# Altium project V1.PrjPcb
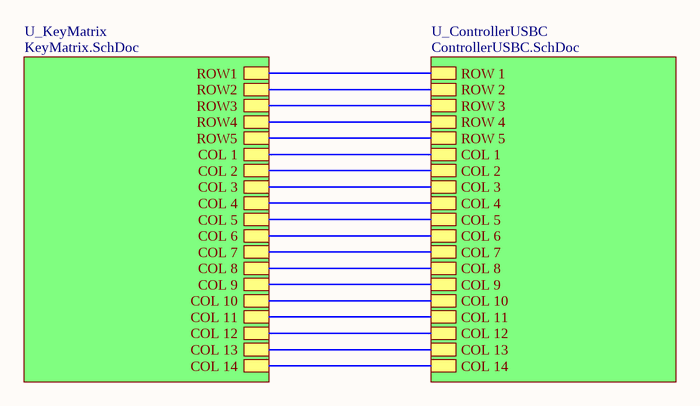
[diagram p0: V1.SchDoc]
3 sheets, 174 parts. Net scope: hierarchical (ports join the sheet entries above them; power ports are global).
Board file: V1.PcbDoc
Sheets:
  V1.SchDoc
    U_ControllerUSBC = ControllerUSBC.SchDoc
    U_KeyMatrix = KeyMatrix.SchDoc

## Sheet V1.SchDoc
size A4; Organization: Altium Limited; Address1: L3, 12a Rodborough Rd; Address2: Frenchs Forest; Address3: NSW; Address4: Australia 2086

### Sub-sheets
U_ControllerUSBC = ControllerUSBC.SchDoc: ROW 1, ROW 2, ROW 3, ROW 4, ROW 5, COL 1, COL 2, COL 3, COL 4, COL 5, COL 6, COL 7, COL 8, COL 9, COL 10, COL 11, COL 12, COL 13, COL 14
U_KeyMatrix = KeyMatrix.SchDoc: ROW1, ROW2, ROW3, ROW4, ROW5, COL 1, COL 2, COL 3, COL 4, COL 5, COL 6, COL 7, COL 8, COL 9, COL 10, COL 11, COL 12, COL 13, COL 14

### Nets
Net0_MX2: sheet U_ControllerUSBC/COL 11, sheet U_KeyMatrix/COL 11
Net1_MX2: sheet U_ControllerUSBC/COL 2, sheet U_KeyMatrix/COL 2
Net2_MX2: sheet U_ControllerUSBC/COL 3, sheet U_KeyMatrix/COL 3
Net3_MX2: sheet U_ControllerUSBC/COL 4, sheet U_KeyMatrix/COL 4
Net4_MX2: sheet U_ControllerUSBC/COL 5, sheet U_KeyMatrix/COL 5
Net5_MX2: sheet U_ControllerUSBC/COL 6, sheet U_KeyMatrix/COL 6
Net6_MX2: sheet U_ControllerUSBC/COL 7, sheet U_KeyMatrix/COL 7
Net7_MX2: sheet U_ControllerUSBC/COL 8, sheet U_KeyMatrix/COL 8
Net8_MX2: sheet U_ControllerUSBC/COL 9, sheet U_KeyMatrix/COL 9
Net9_MX2: sheet U_ControllerUSBC/COL 10, sheet U_KeyMatrix/COL 10
NetAPOSTRO_MX2: sheet U_ControllerUSBC/COL 12, sheet U_KeyMatrix/COL 12
NetBACKSPACE_MX2: sheet U_ControllerUSBC/COL 14, sheet U_KeyMatrix/COL 14
NetCAPS_MX2: sheet U_ControllerUSBC/COL 1, sheet U_KeyMatrix/COL 1
NetD1_C: sheet U_ControllerUSBC/ROW 1, sheet U_KeyMatrix/ROW1
NetD15_C: sheet U_ControllerUSBC/ROW 2, sheet U_KeyMatrix/ROW2
NetD29_C: sheet U_ControllerUSBC/ROW 3, sheet U_KeyMatrix/ROW3
NetD42_C: sheet U_ControllerUSBC/ROW 4, sheet U_KeyMatrix/ROW4
NetD54_C: sheet U_ControllerUSBC/ROW 5, sheet U_KeyMatrix/ROW5
NetENTER_MX2: sheet U_ControllerUSBC/COL 13, sheet U_KeyMatrix/COL 13

### Notes on the sheet
- Title
- Size:
- Date:
- A4
- Number:
- Time:
- Revision:
- Sheet
- of
- File:

## Sheet ControllerUSBC.SchDoc
size A4; Organization: Altium Limited; Address1: L3, 12a Rodborough Rd; Address2: Frenchs Forest; Address3: NSW; Address4: Australia 2086
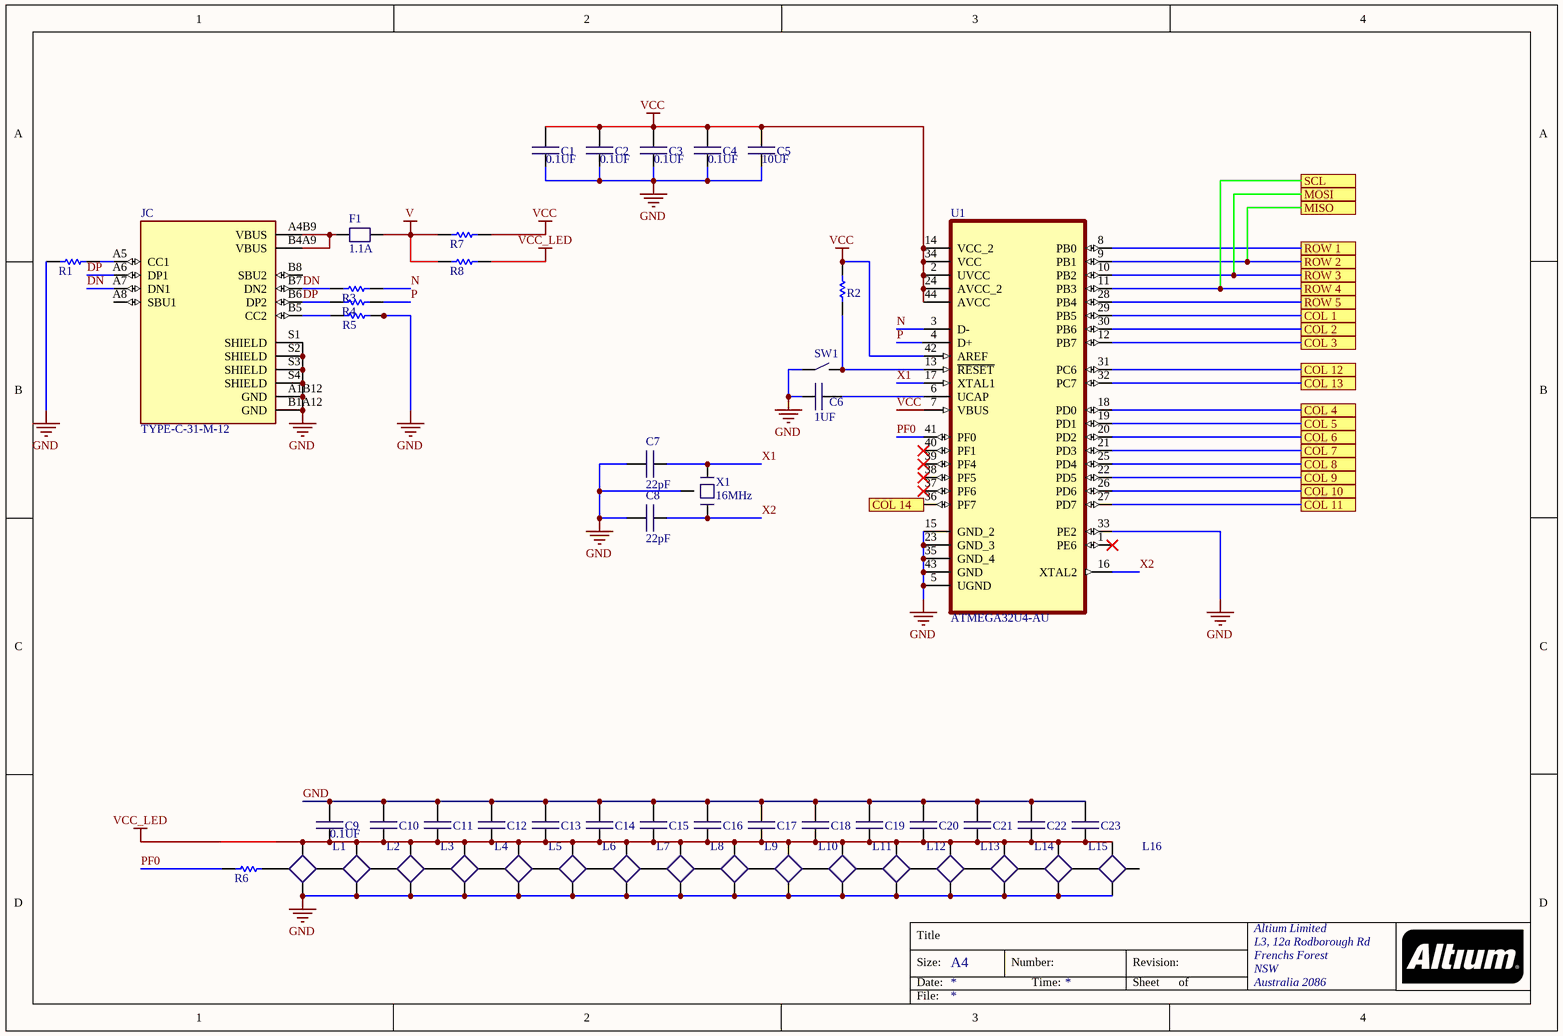
[diagram p1: ControllerUSBC.SchDoc]

### Parts
C1  0.1UF  [C0402]
C2  0.1UF  [C0402]
C3  0.1UF  [C0402]
C4  0.1UF  [C0402]
C5  10UF  [C0402]
C6  1UF  [C0402]
C7  22pF  [C0402]
C8  22pF  [C0402]
C9  0.1UF  [C0402]
C10  0.1UF  [C0402]  (value not drawn)
C11  0.1UF  [C0402]  (value not drawn)
C12  0.1UF  [C0402]  (value not drawn)
C13  0.1UF  [C0402]  (value not drawn)
C14  0.1UF  [C0402]  (value not drawn)
C15  0.1UF  [C0402]  (value not drawn)
C16  0.1UF  [C0402]  (value not drawn)
C17  0.1UF  [C0402]  (value not drawn)
C18  0.1UF  [C0402]  (value not drawn)
C19  0.1UF  [C0402]  (value not drawn)
C20  0.1UF  [C0402]  (value not drawn)
C21  0.1UF  [C0402]  (value not drawn)
C22  0.1UF  [C0402]  (value not drawn)
C23  0.1UF  [C0402]  (value not drawn)
F1  1.1A  [F1206]
JC  TYPE-C-31-M-12  [HRO_TYPE-C-31-M-12]
L1  WS2812B3535  [Neopixel3535]  (value not drawn)
L2  WS2812B3535  [Neopixel3535]  (value not drawn)
L3  WS2812B3535  [Neopixel3535]  (value not drawn)
L4  WS2812B3535  [Neopixel3535]  (value not drawn)
L5  WS2812B3535  [Neopixel3535]  (value not drawn)
L6  WS2812B3535  [Neopixel3535]  (value not drawn)
L7  WS2812B3535  [Neopixel3535]  (value not drawn)
L8  WS2812B3535  [Neopixel3535]  (value not drawn)
L9  WS2812B3535  [Neopixel3535]  (value not drawn)
L10  WS2812B3535  [Neopixel3535]  (value not drawn)
L11  WS2812B3535  [Neopixel3535]  (value not drawn)
L12  WS2812B3535  [Neopixel3535]  (value not drawn)
L13  WS2812B3535  [Neopixel3535]  (value not drawn)
L14  WS2812B3535  [Neopixel3535]  (value not drawn)
L15  WS2812B3535  [Neopixel3535]  (value not drawn)
L16  WS2812B3535  [Neopixel3535]  (value not drawn)
R1  resistor  [R0402]  (value not drawn)
R2  resistor  [R0402]  (value not drawn)
R3  resistor  [R0402]  (value not drawn)
R4  resistor  [R0402]  (value not drawn)
R5  resistor  [R0402]  (value not drawn)
R6  resistor  [R0402]  (value not drawn)
R7  0 Ohm  [R0402]  (value not drawn)
R8  0 Ohm  [R0402]  (value not drawn)
SW1  Switch_Tactile_EVP  [SW_EVP-BB2A9B000]  (value not drawn)
U1  ATMEGA32U4-AU  [QFPN_ATMEGA32U4-44N]
X1  16MHz  [CRYSTAL-3.2X2.5]

### Ports
COL 1, COL 2, COL 3, COL 4, COL 5, COL 6, COL 7, COL 8, COL 9, COL 10, COL 11, COL 12, COL 13, COL 14, MISO, MOSI, ROW 1, ROW 2, ROW 3, ROW 4, ROW 5, SCL

### Nets
GND: C1.1 C2.1 C3.1 C4.1 C5.1 C6.1 C7.2 C8.2 C9.2 C10.2 C11.2 C12.2 C13.2 C14.2 C15.2 C16.2 C17.2 C18.2 C19.2 C20.2 C21.2 C22.2 C23.2 JC.A1B12(GND) JC.B1A12(GND) JC.S1(SHIELD) JC.S2(SHIELD) JC.S3(SHIELD) JC.S4(SHIELD) L1.3-GND(GND) L2.3-GND(GND) L3.3-GND(GND) L4.3-GND(GND) L5.3-GND(GND) L6.3-GND(GND) L7.3-GND(GND) L8.3-GND(GND) L9.3-GND(GND) L10.3-GND(GND) L11.3-GND(GND) L12.3-GND(GND) L13.3-GND(GND) L14.3-GND(GND) L15.3-GND(GND) L16.3-GND(GND) R1.1 R5.2 SW1.A U1.5(UGND) U1.15(GND_2) U1.23(GND_3) U1.33(PE2) U1.35(GND_4) U1.43(GND) X1.2,_4
V: F1.2 R7.1 R8.1
VCC: C1.2 C2.2 C3.2 C4.2 C5.2 R2.2 R7.2 U1.2(UVCC) U1.7(VBUS) U1.14(VCC_2) U1.24(AVCC_2) U1.34(VCC) U1.42(AREF) U1.44(AVCC)
VCC_LED: C9.1 C10.1 C11.1 C12.1 C13.1 C14.1 C15.1 C16.1 C17.1 C18.1 C19.1 C20.1 C21.1 C22.1 C23.1 L1.1-VDD(VDD) L2.1-VDD(VDD) L3.1-VDD(VDD) L4.1-VDD(VDD) L5.1-VDD(VDD) L6.1-VDD(VDD) L7.1-VDD(VDD) L8.1-VDD(VDD) L9.1-VDD(VDD) L10.1-VDD(VDD) L11.1-VDD(VDD) L12.1-VDD(VDD) L13.1-VDD(VDD) L14.1-VDD(VDD) L15.1-VDD(VDD) L16.1-VDD(VDD) R8.2
DN: JC.A7(DN1) JC.B7(DN2) R3.1
DP: JC.A6(DP1) JC.B6(DP2) R4.1
N: R3.2 U1.3(D-)
P: R4.2 U1.4(D+)
PF0: R6.2 U1.41(PF0)
X1: C7.1 U1.17(XTAL1) X1.1
X2: C8.1 U1.16(XTAL2) X1.3
Net0_MX2: U1.27(PD7) ; port COL 11
Net1_MX2: U1.30(PB6) ; port COL 2
Net2_MX2: U1.12(PB7) ; port COL 3
Net3_MX2: U1.18(PD0) ; port COL 4
Net4_MX2: U1.19(PD1) ; port COL 5
Net5_MX2: U1.20(PD2) ; port COL 6
Net6_MX2: U1.21(PD3) ; port COL 7
Net7_MX2: U1.25(PD4) ; port COL 8
Net8_MX2: U1.22(PD5) ; port COL 9
Net9_MX2: U1.26(PD6) ; port COL 10
NetAPOSTRO_MX2: U1.31(PC6) ; port COL 12
NetBACKSPACE_MX2: U1.36(PF7) ; port COL 14
NetC6_2: C6.2 U1.6(UCAP)
NetCAPS_MX2: U1.29(PB5) ; port COL 1
NetD1_C: U1.8(PB0) ; port ROW 1
NetD15_C: U1.9(PB1) ; port ROW 2, port MISO
NetD29_C: U1.10(PB2) ; port ROW 3, port MOSI
NetD42_C: U1.11(PB3) ; port ROW 4, port SCL
NetD54_C: U1.28(PB4) ; port ROW 5
NetENTER_MX2: U1.32(PC7) ; port COL 13
NetF1_1: F1.1 JC.A4B9(VBUS) JC.B4A9(VBUS)
NetJC_A5: JC.A5(CC1) R1.2
NetJC_B5: JC.B5(CC2) R5.1
NetL1_2-DOUT: L1.2-DOUT(DOUT) L2.4-DIN(DIN)
NetL1_4-DIN: L1.4-DIN(DIN) R6.1
NetL2_2-DOUT: L2.2-DOUT(DOUT) L3.4-DIN(DIN)
NetL3_2-DOUT: L3.2-DOUT(DOUT) L4.4-DIN(DIN)
NetL4_2-DOUT: L4.2-DOUT(DOUT) L5.4-DIN(DIN)
NetL5_2-DOUT: L5.2-DOUT(DOUT) L6.4-DIN(DIN)
NetL6_2-DOUT: L6.2-DOUT(DOUT) L7.4-DIN(DIN)
NetL7_2-DOUT: L7.2-DOUT(DOUT) L8.4-DIN(DIN)
NetL8_2-DOUT: L8.2-DOUT(DOUT) L9.4-DIN(DIN)
NetL9_2-DOUT: L9.2-DOUT(DOUT) L10.4-DIN(DIN)
NetL10_2-DOUT: L10.2-DOUT(DOUT) L11.4-DIN(DIN)
NetL11_2-DOUT: L11.2-DOUT(DOUT) L12.4-DIN(DIN)
NetL12_2-DOUT: L12.2-DOUT(DOUT) L13.4-DIN(DIN)
NetL13_2-DOUT: L13.2-DOUT(DOUT) L14.4-DIN(DIN)
NetL14_2-DOUT: L14.2-DOUT(DOUT) L15.4-DIN(DIN)
NetL15_2-DOUT: L15.2-DOUT(DOUT) L16.4-DIN(DIN)
NetR2_1: R2.1 SW1.B U1.13(~{RESET})

Not connected (* = marked no-connect by the designer): JC A8(SBU1) B8(SBU2); L16 2-DOUT(DOUT); U1 1(PE6)* 37(PF6)* 38(PF5)* 39(PF4)* 40(PF1)*

### Notes on the sheet
- Title
- Size:
- Date:
- A4
- Number:
- Time:
- Revision:
- Sheet
- of
- File:

### Library data of the parts
C1-C23 = C0402
F1 = Fuse 1206
JC = TYPE-C-31-M-12: USB Connectors 24 Receptacle 1 8.94*7.3mm RoHS; MF: HRO Electronics Co., Ltd.; Value: *; SnapEDA_Link: https://www.snapeda.com/parts/TYPE-C-31-M-12/HRO%20Electronics%20Co.,%20Ltd./view-part/3228496/?ref=snap; Package: Package; MP: TYPE-C-31-M-12; Price: None; Availability: Unavailable
L1-L16 = WS2812B3535: MF: SparkFun Electronics; Availability: Unavailable; SnapEDA_Link: https://www.snapeda.com/parts/WS2812B/Worldsemi/view-part/1038297/?ref=snap; MP: WS2812B; Price: None; Value: *; Package: None
R5 = resistor: 5.1k
R7 R8 = resistor
U1 = ATMEGA32U4-AU: AVR AVRÂ® ATmega Microcontroller IC 8-Bit 16MHz 32KB _16K x 16_ FLASH 44-TQFP _10x10_; MF: Microchip Technology; Value: *; SnapEDA_Link: https://www.snapeda.com/parts/ATMEGA32U4-AU/Microchip/view-part/4251478/?ref=snap; MP: ATMEGA32U4-AU; Availability: Unavailable; Price: None; Package: TQFP-44 Microchip Technology
X1 = Crystal 3x2.5

## Sheet KeyMatrix.SchDoc
size A4; Organization: Altium Limited; Address1: L3, 12a Rodborough Rd; Address2: Frenchs Forest; Address3: NSW; Address4: Australia 2086
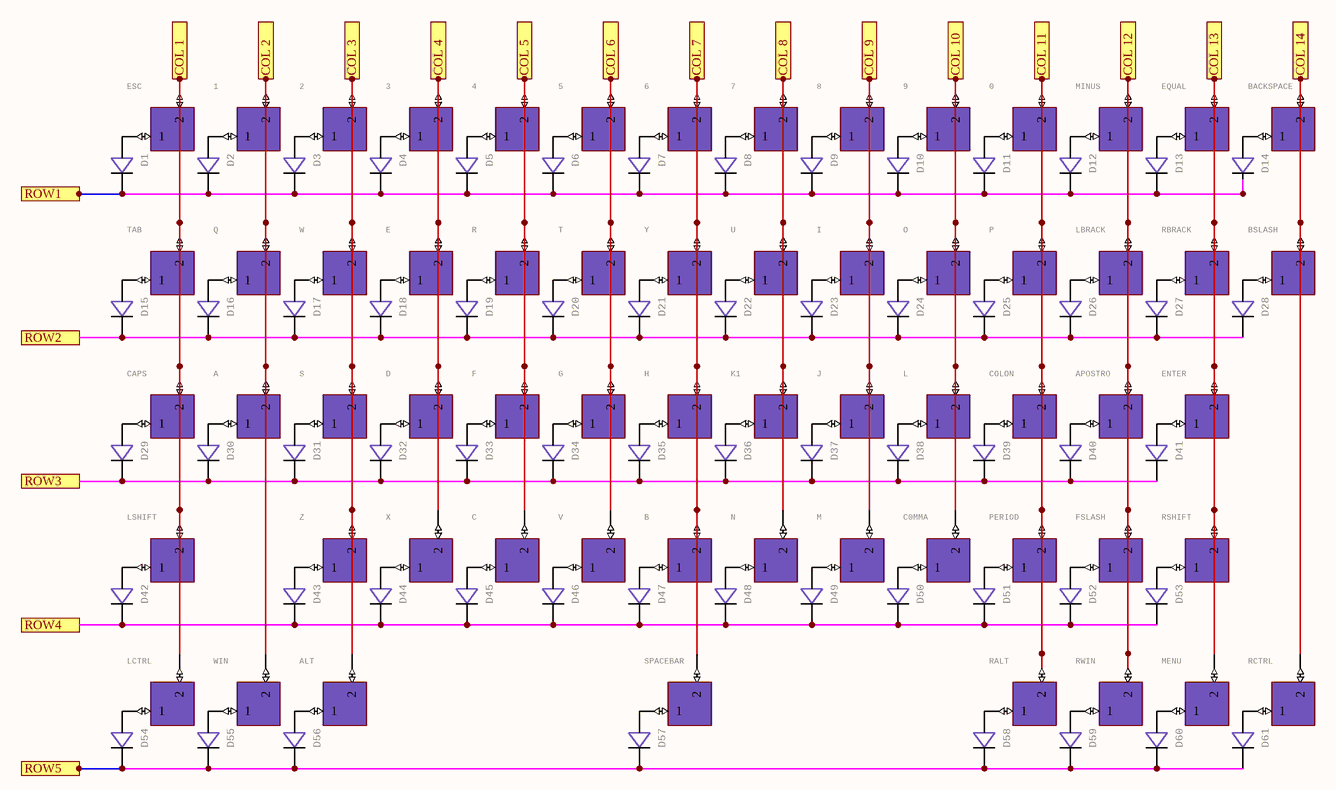
[diagram p2: KeyMatrix.SchDoc]

### Parts
0  KEYSWITCH-PLAIN-MXHSPCB-1U  [MXHSPCB-1U]  (value not drawn)
1  KEYSWITCH-PLAIN-MXHSPCB-1U  [MXHSPCB-1U]  (value not drawn)
2  KEYSWITCH-PLAIN-MXHSPCB-1U  [MXHSPCB-1U]  (value not drawn)
3  KEYSWITCH-PLAIN-MXHSPCB-1U  [MXHSPCB-1U]  (value not drawn)
4  KEYSWITCH-PLAIN-MXHSPCB-1U  [MXHSPCB-1U]  (value not drawn)
5  KEYSWITCH-PLAIN-MXHSPCB-1U  [MXHSPCB-1U]  (value not drawn)
6  KEYSWITCH-PLAIN-MXHSPCB-1U  [MXHSPCB-1U]  (value not drawn)
7  KEYSWITCH-PLAIN-MXHSPCB-1U  [MXHSPCB-1U]  (value not drawn)
8  KEYSWITCH-PLAIN-MXHSPCB-1U  [MXHSPCB-1U]  (value not drawn)
9  KEYSWITCH-PLAIN-MXHSPCB-1U  [MXHSPCB-1U]  (value not drawn)
A  KEYSWITCH-PLAIN-MXHSPCB-1U  [MXHSPCB-1U]  (value not drawn)
ALT  KEYSWITCH-PLAIN-MXHSPCB-1U  [MXHSPCB-1U]  (value not drawn)
APOSTRO  KEYSWITCH-PLAIN-MXHSPCB-1U  [MXHSPCB-1U]  (value not drawn)
B  KEYSWITCH-PLAIN-MXHSPCB-1U  [MXHSPCB-1U]  (value not drawn)
BACKSPACE  KEYSWITCH-PLAIN-MXHSPCB-2U  [MXHSPCB-2U-LEDHOLE]  (value not drawn)
BSLASH  KEYSWITCH-PLAIN-MXHSPCB-1U  [MXHSPCB-1U]  (value not drawn)
C  KEYSWITCH-PLAIN-MXHSPCB-1U  [MXHSPCB-1U]  (value not drawn)
C0MMA  KEYSWITCH-PLAIN-MXHSPCB-1U  [MXHSPCB-1U]  (value not drawn)
CAPS  KEYSWITCH-PLAIN-MXHSPCB-1U  [MXHSPCB-1U]  (value not drawn)
COLON  KEYSWITCH-PLAIN-MXHSPCB-1U  [MXHSPCB-1U]  (value not drawn)
D  KEYSWITCH-PLAIN-MXHSPCB-1U  [MXHSPCB-1U]  (value not drawn)
D1  Standard 1N4148 diode  [SOD-123]  (value not drawn)
D2  Standard 1N4148 diode  [SOD-123]  (value not drawn)
D3  Standard 1N4148 diode  [SOD-123]  (value not drawn)
D4  Standard 1N4148 diode  [SOD-123]  (value not drawn)
D5  Standard 1N4148 diode  [SOD-123]  (value not drawn)
D6  Standard 1N4148 diode  [SOD-123]  (value not drawn)
D7  Standard 1N4148 diode  [SOD-123]  (value not drawn)
D8  Standard 1N4148 diode  [SOD-123]  (value not drawn)
D9  Standard 1N4148 diode  [SOD-123]  (value not drawn)
D10  Standard 1N4148 diode  [SOD-123]  (value not drawn)
D11  Standard 1N4148 diode  [SOD-123]  (value not drawn)
D12  Standard 1N4148 diode  [SOD-123]  (value not drawn)
D13  Standard 1N4148 diode  [SOD-123]  (value not drawn)
D14  Standard 1N4148 diode  [SOD-123]  (value not drawn)
D15  Standard 1N4148 diode  [SOD-123]  (value not drawn)
D16  Standard 1N4148 diode  [SOD-123]  (value not drawn)
D17  Standard 1N4148 diode  [SOD-123]  (value not drawn)
D18  Standard 1N4148 diode  [SOD-123]  (value not drawn)
D19  Standard 1N4148 diode  [SOD-123]  (value not drawn)
D20  Standard 1N4148 diode  [SOD-123]  (value not drawn)
D21  Standard 1N4148 diode  [SOD-123]  (value not drawn)
D22  Standard 1N4148 diode  [SOD-123]  (value not drawn)
D23  Standard 1N4148 diode  [SOD-123]  (value not drawn)
D24  Standard 1N4148 diode  [SOD-123]  (value not drawn)
D25  Standard 1N4148 diode  [SOD-123]  (value not drawn)
D26  Standard 1N4148 diode  [SOD-123]  (value not drawn)
D27  Standard 1N4148 diode  [SOD-123]  (value not drawn)
D28  Standard 1N4148 diode  [SOD-123]  (value not drawn)
D29  Standard 1N4148 diode  [SOD-123]  (value not drawn)
D30  Standard 1N4148 diode  [SOD-123]  (value not drawn)
D31  Standard 1N4148 diode  [SOD-123]  (value not drawn)
D32  Standard 1N4148 diode  [SOD-123]  (value not drawn)
D33  Standard 1N4148 diode  [SOD-123]  (value not drawn)
D34  Standard 1N4148 diode  [SOD-123]  (value not drawn)
D35  Standard 1N4148 diode  [SOD-123]  (value not drawn)
D36  Standard 1N4148 diode  [SOD-123]  (value not drawn)
D37  Standard 1N4148 diode  [SOD-123]  (value not drawn)
D38  Standard 1N4148 diode  [SOD-123]  (value not drawn)
D39  Standard 1N4148 diode  [SOD-123]  (value not drawn)
D40  Standard 1N4148 diode  [SOD-123]  (value not drawn)
D41  Standard 1N4148 diode  [SOD-123]  (value not drawn)
D42  Standard 1N4148 diode  [SOD-123]  (value not drawn)
D43  Standard 1N4148 diode  [SOD-123]  (value not drawn)
D44  Standard 1N4148 diode  [SOD-123]  (value not drawn)
D45  Standard 1N4148 diode  [SOD-123]  (value not drawn)
D46  Standard 1N4148 diode  [SOD-123]  (value not drawn)
D47  Standard 1N4148 diode  [SOD-123]  (value not drawn)
D48  Standard 1N4148 diode  [SOD-123]  (value not drawn)
D49  Standard 1N4148 diode  [SOD-123]  (value not drawn)
D50  Standard 1N4148 diode  [SOD-123]  (value not drawn)
D51  Standard 1N4148 diode  [SOD-123]  (value not drawn)
D52  Standard 1N4148 diode  [SOD-123]  (value not drawn)
D53  Standard 1N4148 diode  [SOD-123]  (value not drawn)
D54  Standard 1N4148 diode  [SOD-123]  (value not drawn)
D55  Standard 1N4148 diode  [SOD-123]  (value not drawn)
D56  Standard 1N4148 diode  [SOD-123]  (value not drawn)
D57  Standard 1N4148 diode  [SOD-123]  (value not drawn)
D58  Standard 1N4148 diode  [SOD-123]  (value not drawn)
D59  Standard 1N4148 diode  [SOD-123]  (value not drawn)
D60  Standard 1N4148 diode  [SOD-123]  (value not drawn)
D61  Standard 1N4148 diode  [SOD-123]  (value not drawn)
E  KEYSWITCH-PLAIN-MXHSPCB-1U  [MXHSPCB-1U]  (value not drawn)
ENTER  KEYSWITCH-PLAIN-MXHSPCB-2U  [MXHSPCB-2U-LEDHOLE]  (value not drawn)
EQUAL  KEYSWITCH-PLAIN-MXHSPCB-1U  [MXHSPCB-1U]  (value not drawn)
ESC  KEYSWITCH-PLAIN-MXHSPCB-1U  [MXHSPCB-1U]  (value not drawn)
F  KEYSWITCH-PLAIN-MXHSPCB-1U  [MXHSPCB-1U]  (value not drawn)
FSLASH  KEYSWITCH-PLAIN-MXHSPCB-1U  [MXHSPCB-1U]  (value not drawn)
G  KEYSWITCH-PLAIN-MXHSPCB-1U  [MXHSPCB-1U]  (value not drawn)
H  KEYSWITCH-PLAIN-MXHSPCB-1U  [MXHSPCB-1U]  (value not drawn)
I  KEYSWITCH-PLAIN-MXHSPCB-1U  [MXHSPCB-1U]  (value not drawn)
J  KEYSWITCH-PLAIN-MXHSPCB-1U  [MXHSPCB-1U]  (value not drawn)
K1  KEYSWITCH-PLAIN-MXHSPCB-1U  [MXHSPCB-1U]  (value not drawn)
L  KEYSWITCH-PLAIN-MXHSPCB-1U  [MXHSPCB-1U]  (value not drawn)
LBRACK  KEYSWITCH-PLAIN-MXHSPCB-1U  [MXHSPCB-1U]  (value not drawn)
LCTRL  KEYSWITCH-PLAIN-MXHSPCB-1U  [MXHSPCB-1U]  (value not drawn)
LSHIFT  KEYSWITCH-PLAIN-MXHSPCB-2U  [MXHSPCB-2U-LEDHOLE]  (value not drawn)
M  KEYSWITCH-PLAIN-MXHSPCB-1U  [MXHSPCB-1U]  (value not drawn)
MENU  KEYSWITCH-PLAIN-MXHSPCB-1U  [MXHSPCB-1U]  (value not drawn)
MINUS  KEYSWITCH-PLAIN-MXHSPCB-1U  [MXHSPCB-1U]  (value not drawn)
N  KEYSWITCH-PLAIN-MXHSPCB-1U  [MXHSPCB-1U]  (value not drawn)
O  KEYSWITCH-PLAIN-MXHSPCB-1U  [MXHSPCB-1U]  (value not drawn)
P  KEYSWITCH-PLAIN-MXHSPCB-1U  [MXHSPCB-1U]  (value not drawn)
PERIOD  KEYSWITCH-PLAIN-MXHSPCB-1U  [MXHSPCB-1U]  (value not drawn)
Q  KEYSWITCH-PLAIN-MXHSPCB-1U  [MXHSPCB-1U]  (value not drawn)
R  KEYSWITCH-PLAIN-MXHSPCB-1U  [MXHSPCB-1U]  (value not drawn)
RALT  KEYSWITCH-PLAIN-MXHSPCB-1U  [MXHSPCB-1U]  (value not drawn)
RBRACK  KEYSWITCH-PLAIN-MXHSPCB-1U  [MXHSPCB-1U]  (value not drawn)
RCTRL  KEYSWITCH-PLAIN-MXHSPCB-1U  [MXHSPCB-1U]  (value not drawn)
RSHIFT  KEYSWITCH-PLAIN-MXHSPCB-2U  [MXHSPCB-2U-LEDHOLE]  (value not drawn)
RWIN  KEYSWITCH-PLAIN-MXHSPCB-1U  [MXHSPCB-1U]  (value not drawn)
S  KEYSWITCH-PLAIN-MXHSPCB-1U  [MXHSPCB-1U]  (value not drawn)
SPACEBAR  KEYSWITCH-PLAIN-MXHSPCB-6.25U  [MXHSPCB-6.25U-FLIPPED]  (value not drawn)
T  KEYSWITCH-PLAIN-MXHSPCB-1U  [MXHSPCB-1U]  (value not drawn)
TAB  KEYSWITCH-PLAIN-MXHSPCB-1U  [MXHSPCB-1U]  (value not drawn)
U  KEYSWITCH-PLAIN-MXHSPCB-1U  [MXHSPCB-1U]  (value not drawn)
V  KEYSWITCH-PLAIN-MXHSPCB-1U  [MXHSPCB-1U]  (value not drawn)
W  KEYSWITCH-PLAIN-MXHSPCB-1U  [MXHSPCB-1U]  (value not drawn)
WIN  KEYSWITCH-PLAIN-MXHSPCB-1U  [MXHSPCB-1U]  (value not drawn)
X  KEYSWITCH-PLAIN-MXHSPCB-1U  [MXHSPCB-1U]  (value not drawn)
Y  KEYSWITCH-PLAIN-MXHSPCB-1U  [MXHSPCB-1U]  (value not drawn)
Z  KEYSWITCH-PLAIN-MXHSPCB-1U  [MXHSPCB-1U]  (value not drawn)

### Ports
COL 1, COL 2, COL 3, COL 4, COL 5, COL 6, COL 7, COL 8, COL 9, COL 10, COL 11, COL 12, COL 13, COL 14, ROW1, ROW2, ROW3, ROW4, ROW5

### Nets
Net0_MX1: 0.MX1(1) D11.A
Net0_MX2: 0.MX2(2) COLON.MX2(2) P.MX2(2) PERIOD.MX2(2) RALT.MX2(2) ; port COL 11
Net1_MX1: 1.MX1(1) D2.A
Net1_MX2: 1.MX2(2) A.MX2(2) Q.MX2(2) WIN.MX2(2) ; port COL 2
Net2_MX1: 2.MX1(1) D3.A
Net2_MX2: 2.MX2(2) ALT.MX2(2) S.MX2(2) W.MX2(2) Z.MX2(2) ; port COL 3
Net3_MX1: 3.MX1(1) D4.A
Net3_MX2: 3.MX2(2) D.MX2(2) E.MX2(2) X.MX2(2) ; port COL 4
Net4_MX1: 4.MX1(1) D5.A
Net4_MX2: 4.MX2(2) C.MX2(2) F.MX2(2) R.MX2(2) ; port COL 5
Net5_MX1: 5.MX1(1) D6.A
Net5_MX2: 5.MX2(2) G.MX2(2) T.MX2(2) V.MX2(2) ; port COL 6
Net6_MX1: 6.MX1(1) D7.A
Net6_MX2: 6.MX2(2) B.MX2(2) H.MX2(2) SPACEBAR.MX2(2) Y.MX2(2) ; port COL 7
Net7_MX1: 7.MX1(1) D8.A
Net7_MX2: 7.MX2(2) K1.MX2(2) N.MX2(2) U.MX2(2) ; port COL 8
Net8_MX1: 8.MX1(1) D9.A
Net8_MX2: 8.MX2(2) I.MX2(2) J.MX2(2) M.MX2(2) ; port COL 9
Net9_MX1: 9.MX1(1) D10.A
Net9_MX2: 9.MX2(2) C0MMA.MX2(2) L.MX2(2) O.MX2(2) ; port COL 10
NetA_MX1: A.MX1(1) D30.A
NetALT_MX1: ALT.MX1(1) D56.A
NetAPOSTRO_MX1: APOSTRO.MX1(1) D40.A
NetAPOSTRO_MX2: APOSTRO.MX2(2) FSLASH.MX2(2) LBRACK.MX2(2) MINUS.MX2(2) RWIN.MX2(2) ; port COL 12
NetB_MX1: B.MX1(1) D47.A
NetBACKSPACE_MX1: BACKSPACE.MX1(1) D14.A
NetBACKSPACE_MX2: BACKSPACE.MX2(2) BSLASH.MX2(2) RCTRL.MX2(2) ; port COL 14
NetBSLASH_MX1: BSLASH.MX1(1) D28.A
NetC0MMA_MX1: C0MMA.MX1(1) D50.A
NetC_MX1: C.MX1(1) D45.A
NetCAPS_MX1: CAPS.MX1(1) D29.A
NetCAPS_MX2: CAPS.MX2(2) ESC.MX2(2) LCTRL.MX2(2) LSHIFT.MX2(2) TAB.MX2(2) ; port COL 1
NetCOLON_MX1: COLON.MX1(1) D39.A
NetD1_A: D1.A ESC.MX1(1)
NetD1_C: D1.C D2.C D3.C D4.C D5.C D6.C D7.C D8.C D9.C D10.C D11.C D12.C D13.C D14.C ; port ROW1
NetD12_A: D12.A MINUS.MX1(1)
NetD13_A: D13.A EQUAL.MX1(1)
NetD15_A: D15.A TAB.MX1(1)
NetD15_C: D15.C D16.C D17.C D18.C D19.C D20.C D21.C D22.C D23.C D24.C D25.C D26.C D27.C D28.C ; port ROW2
NetD16_A: D16.A Q.MX1(1)
NetD17_A: D17.A W.MX1(1)
NetD18_A: D18.A E.MX1(1)
NetD19_A: D19.A R.MX1(1)
NetD20_A: D20.A T.MX1(1)
NetD21_A: D21.A Y.MX1(1)
NetD22_A: D22.A U.MX1(1)
NetD23_A: D23.A I.MX1(1)
NetD24_A: D24.A O.MX1(1)
NetD25_A: D25.A P.MX1(1)
NetD26_A: D26.A LBRACK.MX1(1)
NetD27_A: D27.A RBRACK.MX1(1)
NetD29_C: D29.C D30.C D31.C D32.C D33.C D34.C D35.C D36.C D37.C D38.C D39.C D40.C D41.C ; port ROW3
NetD31_A: D31.A S.MX1(1)
NetD33_A: D33.A F.MX1(1)
NetD34_A: D34.A G.MX1(1)
NetD35_A: D35.A H.MX1(1)
NetD36_A: D36.A K1.MX1(1)
NetD37_A: D37.A J.MX1(1)
NetD38_A: D38.A L.MX1(1)
NetD41_A: D41.A ENTER.MX1(1)
NetD42_A: D42.A LSHIFT.MX1(1)
NetD42_C: D42.C D43.C D44.C D45.C D46.C D47.C D48.C D49.C D50.C D51.C D52.C D53.C ; port ROW4
NetD43_A: D43.A Z.MX1(1)
NetD44_A: D44.A X.MX1(1)
NetD46_A: D46.A V.MX1(1)
NetD48_A: D48.A N.MX1(1)
NetD49_A: D49.A M.MX1(1)
NetD51_A: D51.A PERIOD.MX1(1)
NetD52_A: D52.A FSLASH.MX1(1)
NetD53_A: D53.A RSHIFT.MX1(1)
NetD54_A: D54.A LCTRL.MX1(1)
NetD54_C: D54.C D55.C D56.C D57.C D58.C D59.C D60.C D61.C ; port ROW5
NetD55_A: D55.A WIN.MX1(1)
NetD57_A: D57.A SPACEBAR.MX1(1)
NetD58_A: D58.A RALT.MX1(1)
NetD59_A: D59.A RWIN.MX1(1)
NetD60_A: D60.A MENU.MX1(1)
NetD61_A: D61.A RCTRL.MX1(1)
NetD_MX1: D.MX1(1) D32.A
NetENTER_MX2: ENTER.MX2(2) EQUAL.MX2(2) MENU.MX2(2) RBRACK.MX2(2) RSHIFT.MX2(2) ; port COL 13

### Notes on the sheet
- Title
- Size:
- Date:
- A4
- Number:
- Time:
- Revision:
- Sheet
- of
- File:

### Library data of the parts
0-9 A ALT APOSTRO B BSLASH C C0MMA CAPS COLON D E EQUAL ESC F FSLASH G H I J K1 L LBRACK LCTRL M MENU MINUS N O P PERIOD Q R RALT RBRACK RCTRL RWIN S T TAB U V W WIN X Y Z = KEYSWITCH-PLAIN-MXHSPCB-1U: GateName_1: G$1; SymbolName_1: KEYSWITCH-PLAIN; DeviceName: -MXHSPCB-1U; LibraryName: Keyboard; DeviceSetName: KEYSWITCH-PLAIN; Package: MXHSPCB-1U
BACKSPACE ENTER LSHIFT RSHIFT = KEYSWITCH-PLAIN-MXHSPCB-2U: DeviceName: -MXHSPCB-1U; GateName_1: G$1; SymbolName_1: KEYSWITCH-PLAIN; LibraryName: Keyboard; DeviceSetName: KEYSWITCH-PLAIN; Package: MXHSPCB-1U
D1-D61 = DIODE-SOD-123: GateName_1: D$1; SymbolName_1: DIODE; DeviceName: -SOD-123; LibraryName: Components; DeviceSetName: DIODE; Package: SOD-123
SPACEBAR = KEYSWITCH-PLAIN-MXHSPCB-6.25U: DeviceName: -MXHSPCB-1U; GateName_1: G$1; SymbolName_1: KEYSWITCH-PLAIN; LibraryName: Keyboard; DeviceSetName: KEYSWITCH-PLAIN; Package: MXHSPCB-1U

## Nets that join several sheets
Net0_MX2: ControllerUSBC (U1.27), KeyMatrix (5 pins)
Net1_MX2: ControllerUSBC (U1.30), KeyMatrix (1.MX2 A.MX2 Q.MX2 WIN.MX2)
Net2_MX2: ControllerUSBC (U1.12), KeyMatrix (5 pins)
Net3_MX2: ControllerUSBC (U1.18), KeyMatrix (3.MX2 D.MX2 E.MX2 X.MX2)
Net4_MX2: ControllerUSBC (U1.19), KeyMatrix (4.MX2 C.MX2 F.MX2 R.MX2)
Net5_MX2: ControllerUSBC (U1.20), KeyMatrix (5.MX2 G.MX2 T.MX2 V.MX2)
Net6_MX2: ControllerUSBC (U1.21), KeyMatrix (5 pins)
Net7_MX2: ControllerUSBC (U1.25), KeyMatrix (7.MX2 K1.MX2 N.MX2 U.MX2)
Net8_MX2: ControllerUSBC (U1.22), KeyMatrix (8.MX2 I.MX2 J.MX2 M.MX2)
Net9_MX2: ControllerUSBC (U1.26), KeyMatrix (9.MX2 C0MMA.MX2 L.MX2 O.MX2)
NetAPOSTRO_MX2: ControllerUSBC (U1.31), KeyMatrix (5 pins)
NetBACKSPACE_MX2: ControllerUSBC (U1.36), KeyMatrix (BACKSPACE.MX2 BSLASH.MX2 RCTRL.MX2)
NetCAPS_MX2: ControllerUSBC (U1.29), KeyMatrix (5 pins)
NetD1_C: ControllerUSBC (U1.8), KeyMatrix (14 pins)
NetD15_C: ControllerUSBC (U1.9), KeyMatrix (14 pins)
NetD29_C: ControllerUSBC (U1.10), KeyMatrix (13 pins)
NetD42_C: ControllerUSBC (U1.11), KeyMatrix (12 pins)
NetD54_C: ControllerUSBC (U1.28), KeyMatrix (8 pins)
NetENTER_MX2: ControllerUSBC (U1.32), KeyMatrix (5 pins)